# Altium schematic sheet STB_LightSensors.SchDoc: STB  Sensor Board
size A4; Author: flmoll / gruprecht; DrawnBy: flmoll; Organization: PBL; Revision: A; SheetNumber: 2; SheetTotal: 6
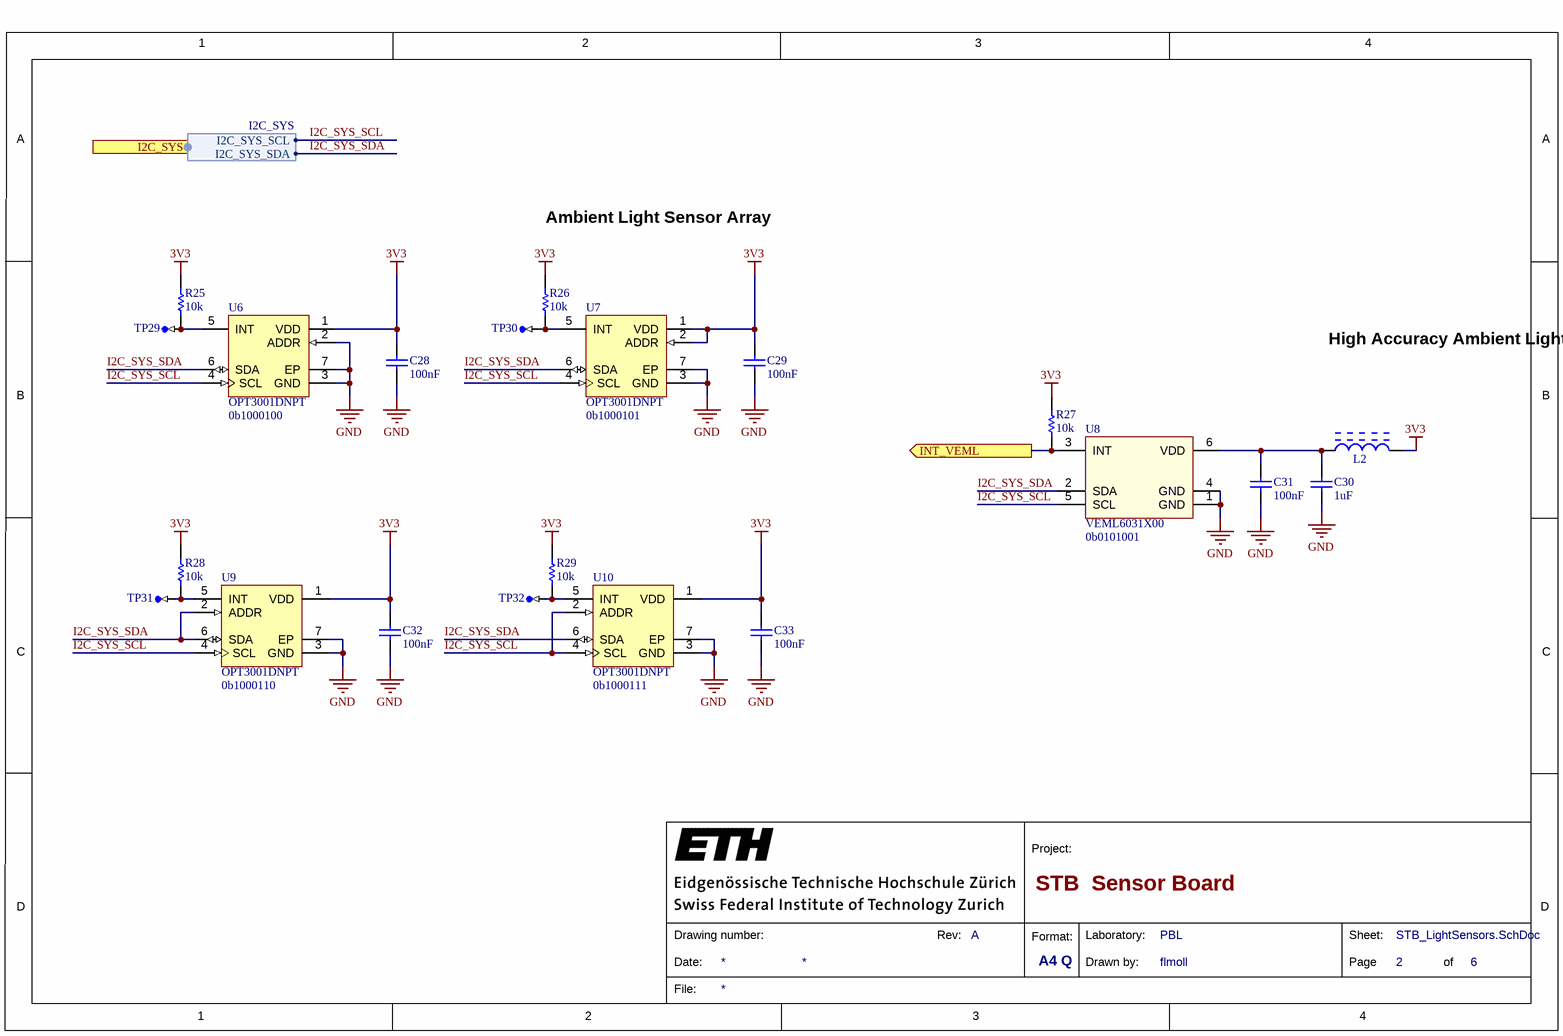
[diagram p0: STB_LightSensors.SchDoc]

## Parts
C28  100nF  [CAPC1050X55X23LL05T13]
C29  100nF  [CAPC1050X55X23LL05T13]
C30  1uF  [CAPC1608X90X35LL15T15]
C31  100nF  [CAPC1050X55X23LL05T13]
C32  100nF  [CAPC1050X55X23LL05T13]
C33  100nF  [CAPC1050X55X23LL05T13]
L2  LI0402E300R-10  [INDC1005X07L]  (value not drawn)
R25  10k  [RESC1005X40X25LL05T05]
R26  10k  [RESC1005X40X25LL05T05]
R27  10k  [RESC1005X40X25LL05T05]
R28  10k  [RESC1005X40X25LL05T05]
R29  10k  [RESC1005X40X25LL05T05]
TP29  testPoint_1mm  [TP-SM-C-100]  (value not drawn)  (no BOM)
TP30  testPoint_1mm  [TP-SM-C-100]  (value not drawn)  (no BOM)
TP31  testPoint_1mm  [TP-SM-C-100]  (value not drawn)  (no BOM)
TP32  testPoint_1mm  [TP-SM-C-100]  (value not drawn)  (no BOM)
U6  OPT3001DNPT  [DNP0006A]
U7  OPT3001DNPT  [DNP0006A]
U8  VEML6031X00  [6-SMD - No Thermal Pad_2]
U9  OPT3001DNPT  [DNP0006A]
U10  OPT3001DNPT  [DNP0006A]

## Ports
I2C_SYS (harness I2C_SYS), INT_VEML (out)

## Harnesses
I2C_SYS: I2C_SYS_SDA, I2C_SYS_SCL

## Nets
3V3: C28.2 C29.2 C32.2 C33.2 L2.2 R25.2 R26.2 R27.2 R28.2 R29.2 U6.1(VDD) U7.1(VDD) U7.2(ADDR) U9.1(VDD) U10.1(VDD)
GND: C28.1 C29.1 C30.1 C31.1 C32.1 C33.1 U6.2(ADDR) U6.3(GND) U6.7(EP) U7.3(GND) U7.7(EP) U8.1(GND) U8.4(GND) U9.3(GND) U9.7(EP) U10.3(GND) U10.7(EP)
I2C_SYS_SCL: U6.4(SCL) U7.4(SCL) U8.5(SCL) U9.4(SCL) U10.2(ADDR) U10.4(SCL) ; port I2C_SYS.I2C_SYS_SCL
I2C_SYS_SDA: U6.6(SDA) U7.6(SDA) U8.2(SDA) U9.2(ADDR) U9.6(SDA) U10.6(SDA) ; port I2C_SYS.I2C_SYS_SDA
INT_VEML: R27.1 U8.3(INT) ; port INT_VEML
NetC30_2: C30.2 C31.2 L2.1 U8.6(VDD)
NetR25_1: R25.1 TP29.TP U6.5(INT)
NetR26_1: R26.1 TP30.TP U7.5(INT)
NetR28_1: R28.1 TP31.TP U9.5(INT)
NetR29_1: R29.1 TP32.TP U10.5(INT)

## Notes on the sheet
- Ambient Light Sensor Array
- High Accuracy Ambient Light Sensor with IR
- (near U6) 0b1000100
- (near U7) 0b1000101
- (near U8) 0b0101001
- (near U9) 0b1000110
- (near U10) 0b1000111
- 1
- 2
- 3
- 4
- A
- B
- C
- Project:
- D
- Date:
- Drawing number:
- Rev:
- Format:
- A4 Q
- Drawn by:
- Laboratory:
- Page
- Sheet:
- of
- File:

## Library data of the parts
C28 C29 C31-C33 = CMP-2000-05439-1: Chip Capacitor, 100 nF, +/- 10%, 16 V, -55 to 125 degC, 0402 (1005 Metric), RoHS, Tape and Reel; Manufacturer: Samsung Electro-Mechanics; Manufacturer Part Number: CL05B104KO5NNNC; Dielectric: X7R; Rated Voltage: 16V; Dielectric Material: Ceramic; Multilayer: Yes; Case Size/Dimension: 0402; Tolerance (%): ±10%; Value: 100nF; Manufacturer URL: http://www.samsungsem.com/global/index.jsp; Datasheet URL: https://datasheet.ciiva.com/29198/458718-da-01-en-vs-kondensator-0402-29198423.pdf; Datasheet Version: Nov-10; Supplier 1: Digi-Key; Supplier Part Number 1: 1276-1001-6-ND; RoHS: Yes; Category: Ceramic Capacitors; Stock 1: 24854634; Pricing 1: 1=0.10000, 10=0.02400, 50=0.01300, 100=0.01050, 500=0.00752, 1000=0.00592, 2500=0.00538, 5000=0.00495 (USD); Mount: Surface Mount; Number of Pins: 2; Package Shape: Rectangular; Size Code: 0402; Terminal Finish: Nickel; Min Operating Temperature: -55°C; Max Operating Temperature: 125°C; JESD-609 Code: e3; Capacitor Type: Ceramic; Negative Tolerance: 10%; Packaging: Tape and Reel; Positive Tolerance: 10%; Rated DC Voltage (URdc): 16V; Temperature Characteristics Code: X7R; Termination: Wraparound; Package Style: SMTMeter; Length: 1mm; Width: 0.5mm; Height: 0.55mm; REACH SVHC: Yes; RoHS Compliant: Yes; ComponentLink1URL: https://datasheet.ciiva.com:443/pdfs/VipMasterIC/IC/SEMS/SEMS-S-A0008384515/SEMS-S-A0008872921-1.pdf?src-supplier=IHS+Markit; ComponentLink1Description: https://datasheet.ciiva.com:443/pdfs/VipMasterIC/IC/SEMS/SEMS-S-A0008384515/SEMS-S-A0008872921-1.pdf?src-supplier=IHS+Markit; ComponentLink2URL: https://datasheet.ciiva.com/26920/getdatasheetpartid-359683-26920169.pdf?src-supplier=Verical; ComponentLink2Description: https://datasheet.ciiva.com/26920/getdatasheetpartid-359683-26920169.pdf?src-supplier=Verical; ComponentLink3URL: https://datasheet.ciiva.com/29198/458718-da-01-en-vs-kondensator-0402-29198423.pdf?src-supplier=Conrad; ComponentLink3Description: https://datasheet.ciiva.com/29198/458718-da-01-en-vs-kondensator-0402-29198423.pdf?src-supplier=Conrad; ComponentLink4URL: https://datasheet.ciiva.com/26309/mlcc-catalogdownload2013-eng-26309003.pdf?src-supplier=Distrelec; ComponentLink4Description: https://datasheet.ciiva.com/26309/mlcc-catalogdownload2013-eng-26309003.pdf?src-supplier=Distrelec; ComponentLink5URL: https://datasheet.ciiva.com/16208/cl05b104kq5nnnc-16208343.pdf?src-supplier=Future+Electronics; ComponentLink5Description: https://datasheet.ciiva.com/16208/cl05b104kq5nnnc-16208343.pdf?src-supplier=Future+Electronics
C30 = CMP-2006-02298-2: Manufacturer: Kemet; Part Number: C0603C105K4RACTU; Dielectric Material: Ceramic; Multilayer: Yes; Negative Tolerance: 10%; Rated DC Voltage (URdc): 16V; Temperature Characteristics Code: X7R; Supplier 1: Digi-Key; Supplier Part Number 1: 399-C0603C105K4RAC7867DKR-ND; Manufacturer Part Number: C0603C105K4RACTU; RoHS: Yes; Category: Ceramic Capacitors; Stock 1: 1549593; Pricing 1: 1=0.10000, 10=0.07700, 50=0.04180, 100=0.03410, 500=0.02440, 1000=0.01916 (USD); Mount: Surface Mount; Number of Pins: 2; Package Shape: Rectangular; Size Code: 0603; Terminal Finish: Nickel; Min Operating Temperature: -55°C; Max Operating Temperature: 125°C; Value: 1uF; Capacitor Type: Ceramic; Packaging: Tape and Reel; Positive Tolerance: 10%; Termination: Wraparound; JESD-609 Code: e3; Package Style: SMTMeter; Length: 1.6mm; Width: 0.8mm; Height: 0.8mm; REACH SVHC: Yes; RoHS Compliant: Yes; ComponentLink1URL: https://datasheet.ciiva.com:443/pdfs/VipMasterIC/IC/KEME/KEME-S-A0008991654/KEME-S-A0008991654-1.pdf?src-supplier=IHS+Markit; ComponentLink1Description: https://datasheet.ciiva.com:443/pdfs/VipMasterIC/IC/KEME/KEME-S-A0008991654/KEME-S-A0008991654-1.pdf?src-supplier=IHS+Markit
L2 = CMP-00193-1: 30 Ohm 1 Power, Signal Line Ferrite Bead 0402 (1005 Metric) 500mA 300 mOhm Max DCR; Manufacturer: Laird-Signal Integrity Products; Number of Lines: 1; Impedance @ Frequency: 30 Ohm @ 100MHz; Packaging: Cut Tape (CT); Part Status: Active; Filter Type: Power, Signal Line; Current Rating (Max): 500mA; DC Resistance (DCR) (Max): 300 mOhm; Ratings: -; Operating Temperature: -40°C ~ 125°C; Package / Case: 0402 (1005 Metric); Mounting Type: Surface Mount; Manufacturer Part Number: LI0402E300R-10; Supplier: Digi-Key; Supplier Part Number: 240-2362-1-ND; ComponentLink1Description: Catalog_EMI%20Filtering%20&%20RF%20Inductors.pdf; ComponentLink1URL: http://cdn.lairdtech.com/home/brandworld/files/Catalog_EMI%20Filtering%20&%20RF%20Inductors.pdf
R25-R29 = CMP-2000-07588-1: Chip Resistor, 10 KOhm, +/- 1%, 0.1 W, -55 to 155 degC, 0402 (1005 Metric), RoHS, Tape and Reel; Manufacturer: Panasonic; Manufacturer Part Number: ERJ-2RKF1002X; Power Rating: 100mW; Voltage Rating: 50V; Value: 10 kOhm; Case\/Package: 0402; Temperature Coefficient: 100ppm\/degreesC; Rated Temperature: 70°C; Package Height: 0.35mm; Package Length: 1mm; Package Width: 0.5mm; Reference Standard: AEC-Q200; RoHSCompliant: True; Lead Free: LeadFree; Package Quantity: 1; Contact Plating: Tin; Length: 1mm; Radiation Hardening: No; REACH SVHC: NoSVHC; Max Operating Temperature: 155degC; Depth: 0.5mm; Case Code (Imperial): 0402; Military Standard: Not; Package Description: 2-Pin Surface Mount Device, Body 1 x 0.5 mm; Termination: SMD/SMT; Case Code (Metric): 1005; Height: 0.35mm; Packaging: TapeandReel; Voltage Rating (DC): 50V; Package Reference: 402; Number of Pins: 2; Tolerance: 1%; Mounting Technology: SurfaceMount; Width: 0.02inch; Mount: SurfaceMount; Datasheet URL: https://industrial.panasonic.com/cdbs/www-data/pdf/RDA0000/AOA0000C304.pdf; Composition: ThickFilm; Datasheet Version: 02/2017; Manufacturer URL: http://www.panasonic.com/; Max Power Dissipation: 100mW; Number of Terminations: 2; Min Operating Temperature: -55degC; Supplier 1: Digi-Key; Supplier Part Number 1: P10.0KLDKR-ND; RoHS: Yes; Category: Chip SMD Resistors; Stock 1: 108; Pricing 1: 1=0.10000, 10=0.03300, 100=0.01330, 1000=0.00599, 2500=0.00520, 5000=0.00429 (USD); Size Code: 0402; Terminal Finish: Nickel; Package Shape: Rectangular; Resistor Type: FIXED RESISTOR; Rated Power Dissipation (P): 100mW; Technology: METAL GLAZE/THICK FILM; Working Voltage: 50V; Construction: Rectangular; Package Style: SMTMeter; JESD-609 Code: e3; RoHS Compliant: Yes; ComponentLink1URL: https://datasheet.ciiva.com:443/pdfs/VipMasterIC/IC/PANA/PANA-S-A0009889626/PANA-S-A0009889626-1.pdf?src-supplier=IHS+Markit; ComponentLink1Description: https://datasheet.ciiva.com:443/pdfs/VipMasterIC/IC/PANA/PANA-S-A0009889626/PANA-S-A0009889626-1.pdf?src-supplier=IHS+Markit; ComponentLink2URL: https://datasheet.ciiva.com/11821/0900766b80f80784-11821171.pdf?src-supplier=RSComponents; ComponentLink2Description: https://datasheet.ciiva.com/11821/0900766b80f80784-11821171.pdf?src-supplier=RSComponents; ComponentLink3URL: https://datasheet.ciiva.com/27055/1987020-27055643.pdf?src-supplier=Jameco; ComponentLink3Description: https://datasheet.ciiva.com/27055/1987020-27055643.pdf?src-supplier=Jameco; ComponentLink4URL: https://datasheet.ciiva.com/43467/1678782-43467402.pdf?src-supplier=Farnell; ComponentLink4Description: https://datasheet.ciiva.com/43467/1678782-43467402.pdf?src-supplier=Farnell; ComponentLink5URL: https://datasheet.ciiva.com/28514/1678782-28514185.pdf?src-supplier=Element14; ComponentLink5Description: https://datasheet.ciiva.com/28514/1678782-28514185.pdf?src-supplier=Element14; ComponentLink6URL: https://datasheet.ciiva.com/24023/aoa0000ce2-24023017.pdf?src-supplier=Mouser; ComponentLink6Description: https://datasheet.ciiva.com/24023/aoa0000ce2-24023017.pdf?src-supplier=Mouser; ComponentLink7URL: https://datasheet.ciiva.com/16782/70260748-16782590.pdf?src-supplier=Allied+Electronics; ComponentLink7Description: https://datasheet.ciiva.com/16782/70260748-16782590.pdf?src-supplier=Allied+Electronics; ComponentLink8URL: https://datasheet.ciiva.com/16786/70260748-16786734.pdf?src-supplier=Allied+Electronics; ComponentLink8Description: https://datasheet.ciiva.com/16786/70260748-16786734.pdf?src-supplier=Allied+Electronics; ComponentLink9URL: https://datasheet.ciiva.com/9194/aoa0000ce2-9194142.pdf?src-supplier=Avnet; ComponentLink9Description: https://datasheet.ciiva.com/9194/aoa0000ce2-9194142.pdf?src-supplier=Avnet; ComponentLink10URL: https://datasheet.ciiva.com/16199/aoa0000ce2-16199478.pdf?src-supplier=Future+Electronics; ComponentLink10Description: https://datasheet.ciiva.com/16199/aoa0000ce2-16199478.pdf?src-supplier=Future+Electronics; ComponentLink11URL: https://datasheet.ciiva.com/48531/aoa0000ce2-48531069.pdf?src-supplier=Avnet; ComponentLink11Description: https://datasheet.ciiva.com/48531/aoa0000ce2-48531069.pdf?src-supplier=Avnet; ComponentLink12URL: https://datasheet.ciiva.com/30201/aoa0000ce2-30201022.pdf?src-supplier=Onlinecomponents.com; ComponentLink12Description: https://datasheet.ciiva.com/30201/aoa0000ce2-30201022.pdf?src-supplier=Onlinecomponents.com
TP29-TP32 = testPoint_1mm: testPoint 1mm
U6 U7 U9 U10 = CMP-2000-06867-1: Ambient Light Sensor (ALS), 1.6 to 3.6 V, -40 to 85 degC, 6-Pin USON (DNP), Green (RoHS & no Sb/Br), Tape and Reel; Manufacturer: Texas Instruments; Max Processing Temp: 260; Peak Wavelength: 550nm; Minimum Operating Supply Voltage: 1.6; Maximum Clock Frequency: 2600; Maximum Operating Supply Voltage: 3.6; Lux Range: 0.01to83000; Typical Supply Current: 3.7; Lead Finish: Gold; Interface Type: Serial(2-Wire,I2C,SMBus); Sensor Type: LighttoDigital; Output Type: Digital; Mounting: SurfaceMount; Operating Temperature: -40to85C; Audio I/O: No; Mounting Technology: SurfaceMount; Package URL: http://www.ti.com/lit/ml/mpds564/mpds564.pdf; Ethernet: No; Package Reference: DNP6; Package Description: 6-Pin Plastic Small Outline No-Lead, Body 2 x 2 mm, Pitch 0.65 mm, Thermal Pad 1.35 x 0.65 mm; Datasheet Version: Rev. B, 12/2014; Manufacturer URL: http://www.ti.com/; Datasheet URL: http://www.ti.com/lit/ds/symlink/opt3001.pdf; GPIO: No; Manufacturer Part Number: OPT3001DNPT
U8 = CMP-02054-1: Ambient Light Sensor, I²C 6-SMD, No Lead; Mfr: Vishay Semiconductor Opto Division; Manufacturer: Vishay; Proximity Detection: Yes; Voltage - Supply: 2.5V ~ 3.6V; Series: -; Type: Ambient; Wavelength: -; Output Type: I²C; Operating Temperature: -40°C ~ 110°C (TA); Mounting Type: Surface Mount; Package / Case: 6-SMD, No Lead; Supplier Device Package: 6-SMD; Supplier 1: Farnell; Supplier Part Number 1: 3765835; Manufacturer Part Number: VEML6031X00; RoHS: No; Category: Uncategorized; Stock 1: 2982; Pricing 1: 1=3.35000, 10=2.44000, 25=2.28000, 50=2.16000 (GBP)